# Altium schematic sheet Blockout.SchDoc
size A0; SheetNumber: 3; SheetTotal: 3
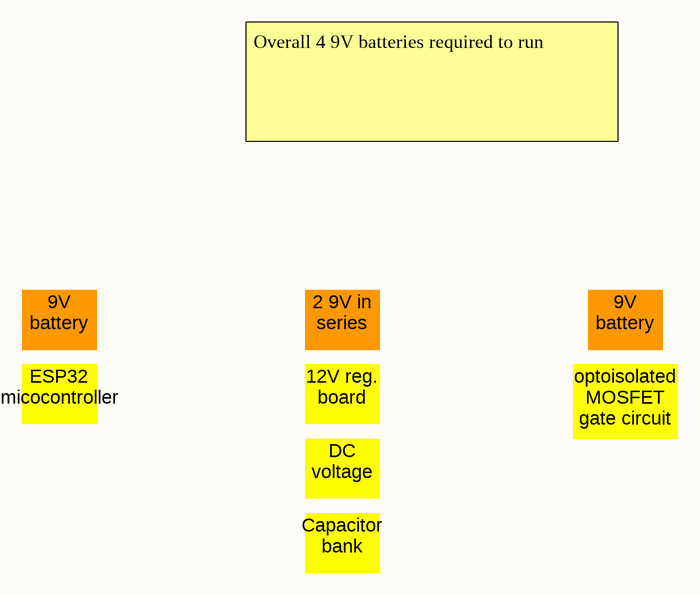
[diagram p0: Blockout.SchDoc]

## Notes on the sheet
- Overall 4 9V batteries required to run
- 9V battery
- 2 9V in series
- ESP32 micocontroller power
- 12V reg. board
- optoisolated MOSFET gate circuit
- DC voltage board
- Capacitor bank